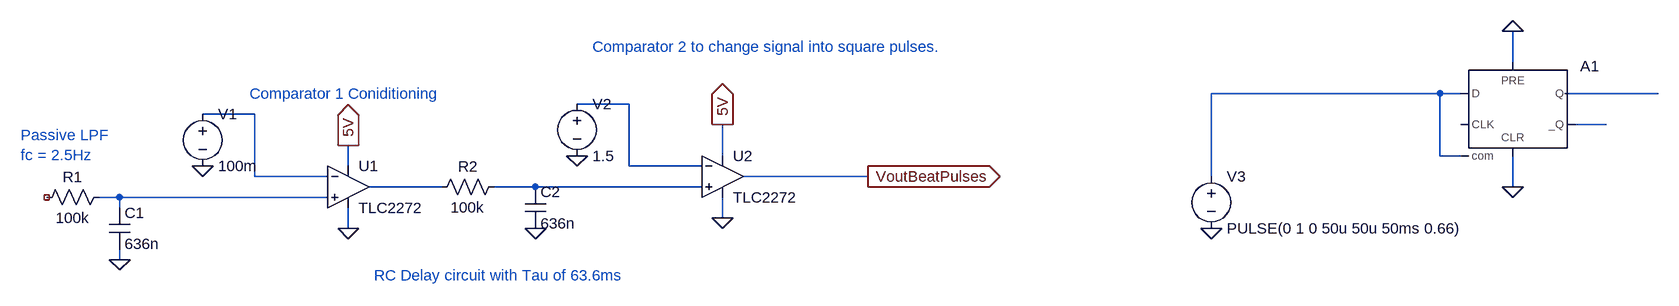
[diagram p0: schematic testing.asc]
testing.asc, the LTspice schematic file:
Version 4
SHEET 1 880 680
WIRE 336 64 336 16
WIRE 224 112 -128 112
WIRE 256 112 224 112
WIRE 560 112 416 112
WIRE -1024 128 -1104 128
WIRE -1600 144 -1680 144
WIRE 480 160 432 160
WIRE -880 208 -880 160
WIRE 224 208 224 112
WIRE 256 208 224 208
WIRE -1456 224 -1456 192
WIRE -1024 224 -1024 128
WIRE -912 224 -1024 224
WIRE -1600 240 -1600 144
WIRE -1488 240 -1600 240
WIRE -656 240 -848 240
WIRE -128 240 -128 112
WIRE -1312 256 -1424 256
WIRE -1168 256 -1232 256
WIRE -912 256 -1168 256
WIRE 336 256 336 208
WIRE -1808 272 -1840 272
WIRE -1488 272 -1808 272
WIRE -1808 288 -1808 272
WIRE -880 304 -880 272
WIRE -1456 320 -1456 288
WIRE -1808 368 -1808 352
FLAG 336 256 0
FLAG -128 320 0
FLAG 336 16 0
FLAG -1808 368 0
FLAG -1456 320 0
FLAG -1680 224 0
FLAG -1168 320 0
FLAG -880 304 0
FLAG -1104 208 0
FLAG -656 240 VoutBeatPulses
IOPIN -656 240 Out
FLAG -1456 192 5V
IOPIN -1456 192 Out
FLAG -880 160 5V
IOPIN -880 160 Out
SYMBOL Digital\\dflop 336 64 R0
SYMATTR InstName A1
SYMATTR SpiceLine Vhigh 5 Trise 10n
SYMBOL voltage -128 224 R0
WINDOW 123 0 0 Left 0
WINDOW 39 0 0 Left 0
SYMATTR InstName V3
SYMATTR Value PULSE(0 1 0 50u 50u 50ms 0.66)
SYMBOL res -1824 256 R90
WINDOW 0 0 56 VBottom 2
WINDOW 3 32 56 VTop 2
SYMATTR InstName R1
SYMATTR Value 100k
SYMBOL cap -1824 288 R0
SYMATTR InstName C1
SYMATTR Value 636n
SYMBOL Opamps\\opamp2 -1456 192 R0
SYMATTR InstName U1
SYMATTR Value TLC2272
SYMBOL voltage -1680 128 R0
WINDOW 123 0 0 Left 0
WINDOW 39 0 0 Left 0
SYMATTR InstName V1
SYMATTR Value 100m
SYMBOL cap -1184 256 R0
SYMATTR InstName C2
SYMATTR Value 636n
SYMBOL res -1216 240 R90
WINDOW 0 0 56 VBottom 2
WINDOW 3 32 56 VTop 2
SYMATTR InstName R2
SYMATTR Value 100k
SYMBOL Opamps\\opamp2 -880 176 R0
SYMATTR InstName U2
SYMATTR Value TLC2272
SYMBOL voltage -1104 112 R0
WINDOW 123 0 0 Left 0
WINDOW 39 0 0 Left 0
SYMATTR InstName V2
SYMATTR Value 1.5
TEXT -1608 112 Left 2 ;Comparator 1 Coniditioning
TEXT -1960 176 Left 2 ;Passive LPF\nfc = 2.5Hz
TEXT -1416 392 Left 2 ;RC Delay circuit with Tau of 63.6ms
TEXT -1080 40 Left 2 ;Comparator 2 to change signal into square pulses.

The netlist it stands for:
* testing.asc
A1 N001 N001 N001 0 0 N005 N002 N001 DFLOP Vhigh 5 Trise 10n
V3 N001 0 PULSE(0 1 0 50u 50u 50ms 0.66)
R1 N008 NC_01 100k
C1 N008 0 636n
XU1 N008 N004 5V 0 N006 TLC2272  ; pins In+ In- V+ V- OUT
V1 N004 0 100m
C2 N007 0 636n
R2 N007 N006 100k
XU2 N007 N003 5V 0 VoutBeatPulses TLC2272  ; pins In+ In- V+ V- OUT
V2 N003 0 1.5
* Comparator 1 Coniditioning
* Passive LPF
* fc = 2.5Hz
* RC Delay circuit with Tau of 63.6ms
* Comparator 2 to change signal into square pulses.
.backanno
.end